# Altium schematic sheet Global.SchDoc
size 431 x 279 mm; SheetNumber: 1; SheetTotal: 6
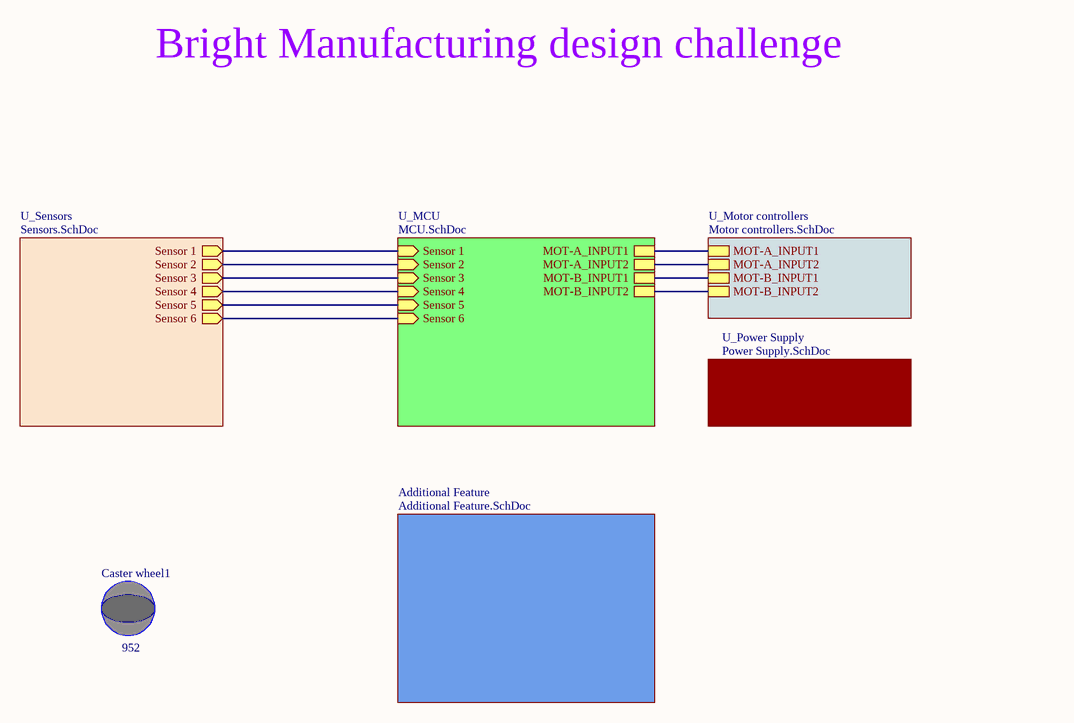
[diagram p0: Global.SchDoc]

## Parts
Caster_wheel1  952  [952-Footprint-1]

## Sub-sheets
Additional Feature = Additional Feature.SchDoc: no entries
U_MCU = MCU.SchDoc: MOT-A_INPUT1, MOT-B_INPUT1, MOT-A_INPUT2, MOT-B_INPUT2, Sensor 1 (in), Sensor 2 (in), Sensor 3 (in), Sensor 4 (in), Sensor 5 (in), Sensor 6 (in)
U_Motor controllers = Motor controllers.SchDoc: MOT-A_INPUT1, MOT-B_INPUT1, MOT-A_INPUT2, MOT-B_INPUT2
U_Power Supply = Power Supply.SchDoc: no entries
U_Sensors = Sensors.SchDoc: Sensor 1 (out), Sensor 2 (out), Sensor 3 (out), Sensor 4 (out), Sensor 5 (out), Sensor 6 (out)

## Nets
(unnamed): sheet U_MCU/MOT-A_INPUT1, sheet U_Motor controllers/MOT-A_INPUT1
(unnamed): sheet U_MCU/MOT-B_INPUT1, sheet U_Motor controllers/MOT-B_INPUT1
(unnamed): sheet U_MCU/MOT-A_INPUT2, sheet U_Motor controllers/MOT-A_INPUT2
(unnamed): sheet U_MCU/MOT-B_INPUT2, sheet U_Motor controllers/MOT-B_INPUT2
(unnamed): sheet U_MCU/Sensor 1, sheet U_Sensors/Sensor 1
(unnamed): sheet U_MCU/Sensor 2, sheet U_Sensors/Sensor 2
(unnamed): sheet U_MCU/Sensor 3, sheet U_Sensors/Sensor 3
(unnamed): sheet U_MCU/Sensor 4, sheet U_Sensors/Sensor 4
(unnamed): sheet U_MCU/Sensor 5, sheet U_Sensors/Sensor 5
(unnamed): sheet U_MCU/Sensor 6, sheet U_Sensors/Sensor 6

## Notes on the sheet
- Bright Manufacturing design challenge
- 4
- 3
- DWG NO.
- REV
- 2
- 1
- DESCRIPTION
- ECO #
- DATE
- ALL INFORMATION IN THIS DRAWING IS THE PROPERTY OF EMAC, AND CANNOT BE COPIED OR USED WITHOUT THE WRITTEN APPROVAL OF EMAC.
- D
- C
- B
- TOLERANCES :
- DIMENSIONS ARE IN INCHES
- UNLESS OTHERWISE SPECIFIED
- CONTRACT NO.
- DRAWN BY
- 2025 Bright Manufacturing Challenge
- .XX
- .XXX
- SURFACE FINISH =           OR BETTER
- ±
- .005
- .01
- FRACTIONS
- ANGLES
- 63
- 1/64
- °
- CHECKED BY
- SCHEMATIC
- A
- MATERIAL
- DRAWING PER ASME-Y14.5-1994
- DEBURR & BREAK ALL SHARP EDGES.
- RESP ENGR
- SIZE
- CODE IDENT
- 0BJZ8
- FINISH
- DESIGN ACTIVITY APPROVAL
- NONE
- SCALE
- WEIGHT
- NA
- SHEET
- OF
- REV. A, 06/21/2025
- FORM #PDE-0001-0001

## Library data of the parts
Caster_wheel1 = CMP-00025-1: Ball Caster With 1/2" Plastic